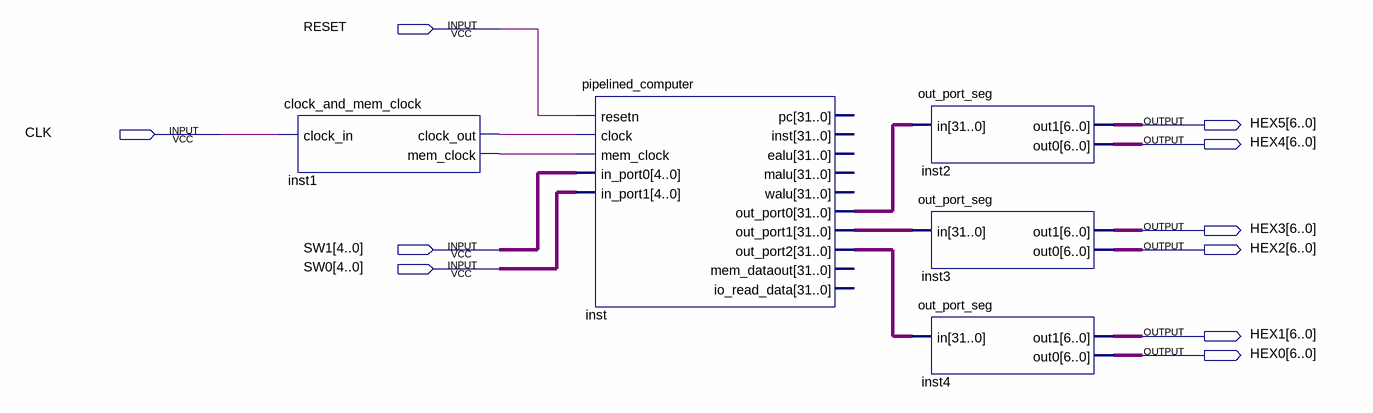
[diagram p0: schematic sheet]
// Quartus schematic pipeline_computer.bdf as structural Verilog: 5 symbols, 10 pins
module pipeline_computer (
  input  RESET,
  input  CLK,
  input  [4:0] SW1,
  input  [4:0] SW0,
  output [6:0] HEX5,
  output [6:0] HEX4,
  output [6:0] HEX3,
  output [6:0] HEX2,
  output [6:0] HEX1,
  output [6:0] HEX0
);

  wire inst1_clock_out, inst1_mem_clock;
  wire [31:0] inst_out_port0, inst_out_port1, inst_out_port2;

  clock_and_mem_clock inst1 (.clock_in(CLK), .clock_out(inst1_clock_out), .mem_clock(inst1_mem_clock));
  pipelined_computer inst (
    .resetn(RESET), .clock(inst1_clock_out), .mem_clock(inst1_mem_clock), .in_port0(SW1), .in_port1(SW0),
    .out_port0(inst_out_port0), .out_port1(inst_out_port1), .out_port2(inst_out_port2));  // open: pc, inst, ealu, malu, walu, mem_dataout, io_read_data
  out_port_seg inst2 (.in(inst_out_port0), .out1(HEX5), .out0(HEX4));
  out_port_seg inst3 (.in(inst_out_port1), .out1(HEX3), .out0(HEX2));
  out_port_seg inst4 (.in(inst_out_port2), .out1(HEX1), .out0(HEX0));
endmodule
